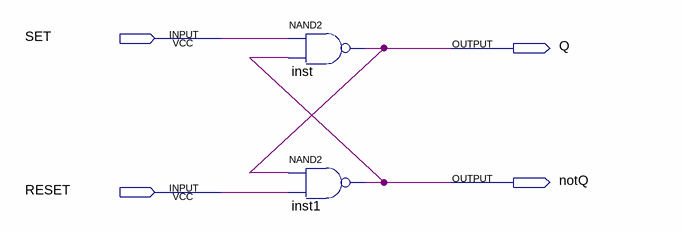
[diagram p0: schematic sheet]
// Quartus schematic ff_rs_nclock.bdf as structural Verilog: 2 symbols, 4 pins
module ff_rs_nclock (
  input  SET,
  input  RESET,
  output Q,
  output notQ
);

  nand inst (Q, SET, notQ);
  nand inst1 (notQ, Q, RESET);
endmodule
